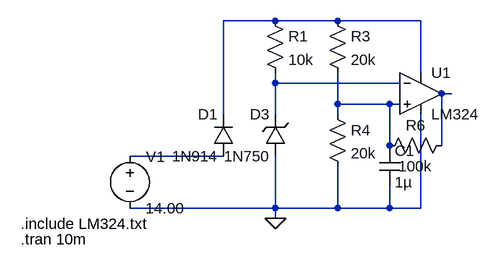
[diagram p0: schematic Comperator.asc]
Comperator.asc, the LTspice schematic file:
Version 4
SHEET 1 880 680
WIRE 240 224 160 224
WIRE 336 224 240 224
WIRE 464 224 336 224
WIRE 464 304 464 224
WIRE 240 320 240 304
WIRE 432 320 240 320
WIRE 512 336 496 336
WIRE 336 352 336 304
WIRE 416 352 336 352
WIRE 432 352 416 352
WIRE 160 368 160 224
WIRE 240 368 240 320
WIRE 336 368 336 352
WIRE 416 416 416 352
WIRE 496 416 496 336
WIRE 160 432 16 432
WIRE 240 512 240 432
WIRE 240 512 16 512
WIRE 336 512 336 448
WIRE 336 512 240 512
WIRE 416 512 416 480
WIRE 416 512 336 512
WIRE 464 512 464 368
WIRE 464 512 416 512
WIRE 240 528 240 512
FLAG 240 528 0
SYMBOL diode 176 432 R180
WINDOW 0 24 64 Left 2
WINDOW 3 24 0 Left 2
SYMATTR InstName D1
SYMATTR Value 1N914
SYMBOL res 224 208 R0
SYMATTR InstName R1
SYMATTR Value 10k
SYMBOL res 320 208 R0
SYMATTR InstName R3
SYMATTR Value 20k
SYMBOL res 320 352 R0
SYMATTR InstName R4
SYMATTR Value 20k
SYMBOL OpAmps/opamp2 464 272 R0
SYMATTR InstName U1
SYMATTR Value LM324
SYMBOL voltage 16 416 R0
WINDOW 0 25 17 Left 2
SYMATTR InstName V1
SYMATTR Value 14.00
SYMBOL zener 256 432 R180
WINDOW 0 24 64 Left 2
WINDOW 3 24 0 Left 2
SYMATTR InstName D3
SYMATTR Value 1N750
SYMBOL cap 400 416 R0
SYMATTR InstName C1
SYMATTR Value 1µ
SYMATTR SpiceLine Rser=34.1m Lser=0 mfg="KEMET" pn="C1812F105K5RAC" type="X7R"
SYMBOL res 512 400 R90
WINDOW 0 0 56 VBottom 2
WINDOW 3 32 56 VTop 2
SYMATTR InstName R6
SYMATTR Value 100k
TEXT -152 560 Left 2 !.tran 10m
TEXT -152 536 Left 2 !.include LM324.txt

The netlist it stands for:
* Comperator.asc
D1 N005 N001 1N914
R1 N001 N002 10k
R3 N001 N004 20k
R4 N004 0 20k
XU1 N004 N002 N001 0 N003 LM324  ; pins In+ In- V+ V- OUT
V1 N005 0 14.00
D3 0 N002 1N750
C1 N004 0 1µ Rser=34.1m Lser=0 mfg="KEMET" pn="C1812F105K5RAC" type="X7R"
R6 N003 N004 100k
.model D D
.lib standard.dio
.tran 10m
.include LM324.txt
.backanno
.end